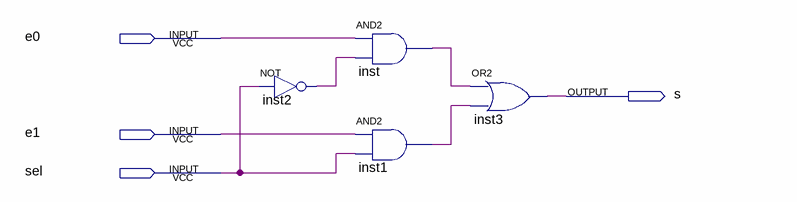
[diagram p0: schematic sheet]
// Quartus schematic MUX2x1.bdf as structural Verilog: 4 symbols, 4 pins
module MUX2x1 (
  input  e0,
  input  e1,
  input  sel,
  output s
);

  wire inst1_out, inst2_out, inst_out;

  not inst2 (inst2_out, sel);
  and inst (inst_out, e0, inst2_out);
  and inst1 (inst1_out, e1, sel);
  or inst3 (s, inst_out, inst1_out);
endmodule
